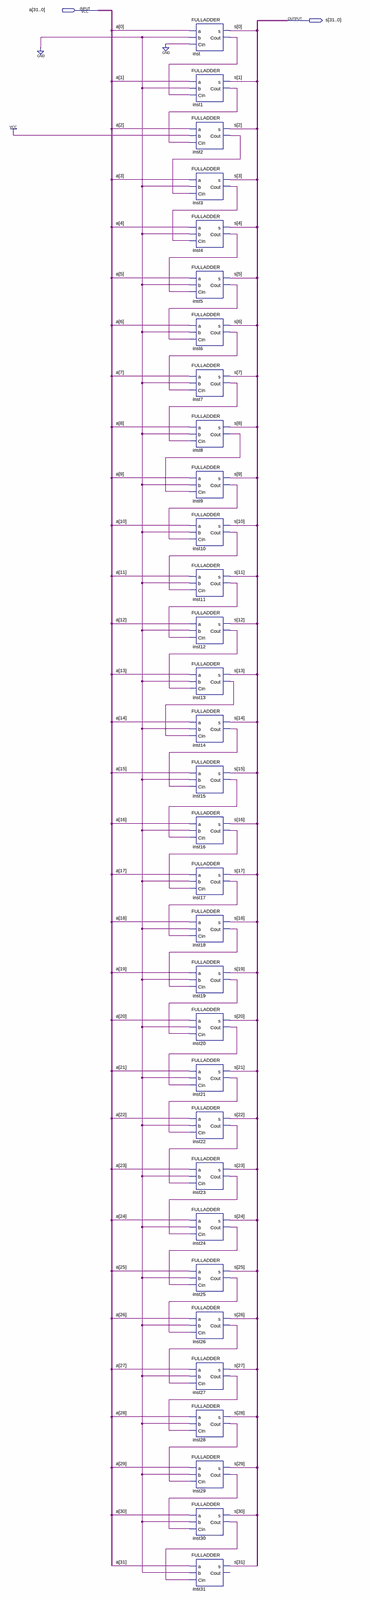
[diagram p0: schematic sheet, whole]
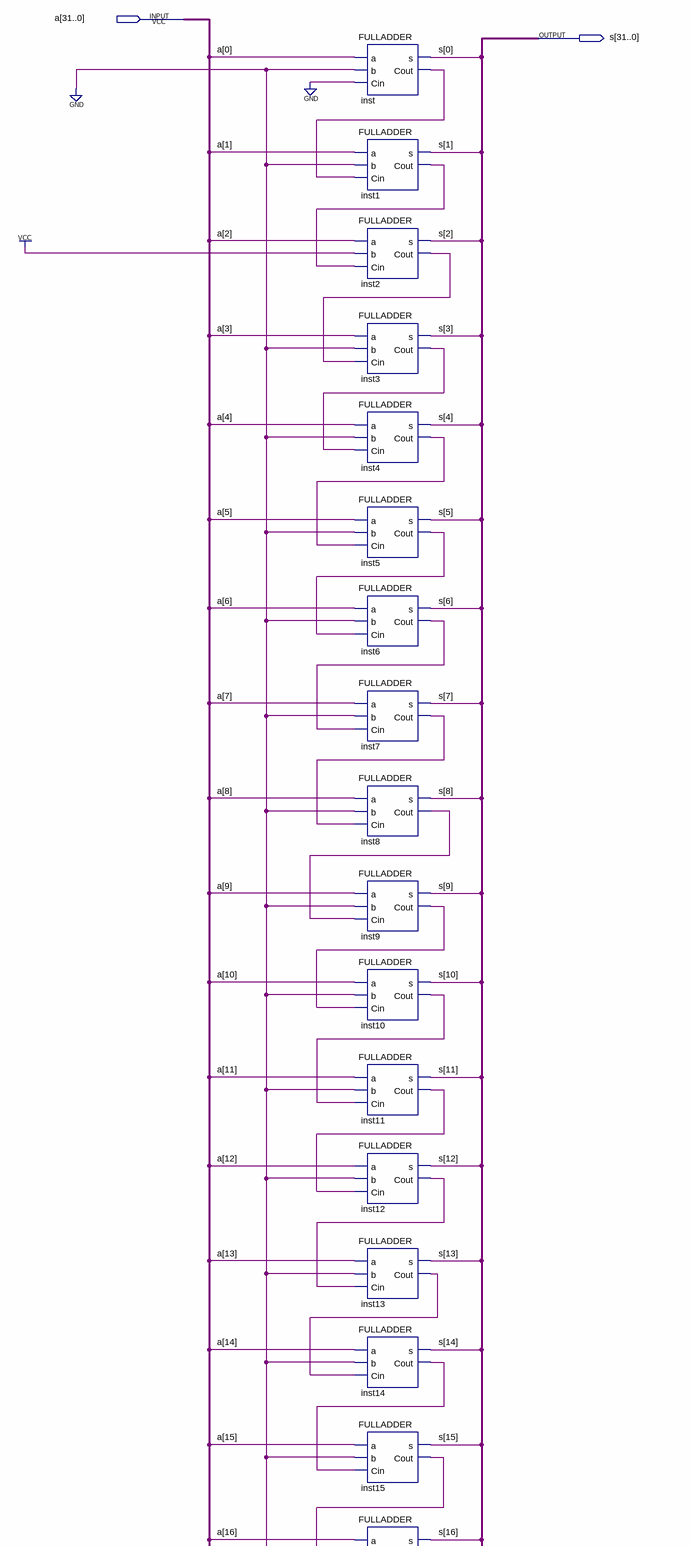
[diagram p1: schematic sheet, upper part]
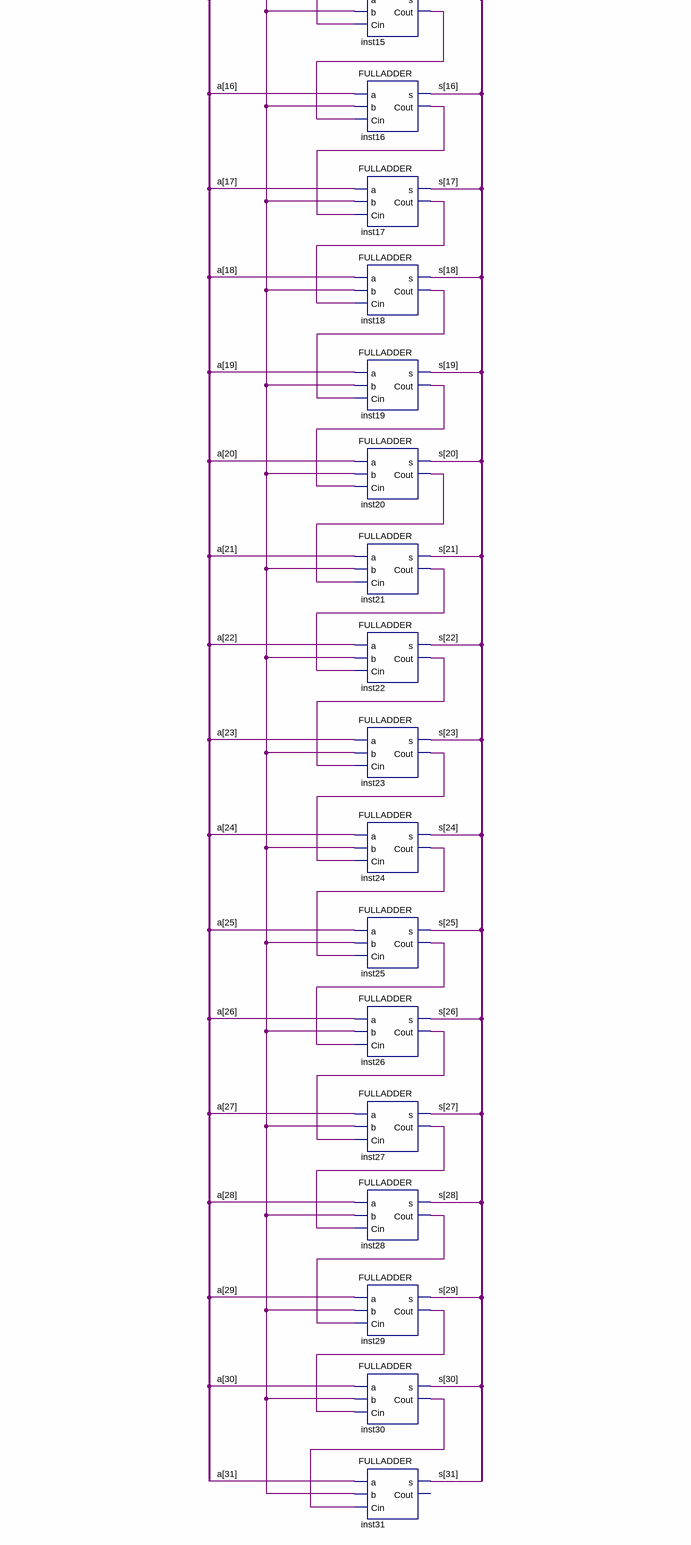
[diagram p2: schematic sheet, lower part]
// Quartus schematic ULA_PC.bdf as structural Verilog: 32 symbols, 2 pins
module ULA_PC (
  input  [31:0] a,
  output [31:0] s
);

  wire inst1_cout, inst2_cout, inst3_cout, inst4_cout, inst5_cout, inst6_cout, inst7_cout, inst8_cout,
       inst9_cout, inst10_cout, inst11_cout, inst12_cout, inst13_cout, inst14_cout, inst15_cout, inst16_cout,
       inst17_cout, inst18_cout, inst19_cout, inst20_cout, inst21_cout, inst22_cout, inst23_cout,
       inst24_cout, inst25_cout, inst26_cout, inst27_cout, inst28_cout, inst29_cout, inst30_cout, inst_cout;

  FULLADDER inst (.a(a[0]), .b(1'b0), .Cin(1'b0), .s(s[0]), .Cout(inst_cout));
  FULLADDER inst1 (.a(a[1]), .b(1'b0), .Cin(inst_cout), .s(s[1]), .Cout(inst1_cout));
  FULLADDER inst2 (.a(a[2]), .b(1'b1), .Cin(inst1_cout), .s(s[2]), .Cout(inst2_cout));
  FULLADDER inst3 (.a(a[3]), .b(1'b0), .Cin(inst2_cout), .s(s[3]), .Cout(inst3_cout));
  FULLADDER inst4 (.a(a[4]), .b(1'b0), .Cin(inst3_cout), .s(s[4]), .Cout(inst4_cout));
  FULLADDER inst5 (.a(a[5]), .b(1'b0), .Cin(inst4_cout), .s(s[5]), .Cout(inst5_cout));
  FULLADDER inst6 (.a(a[6]), .b(1'b0), .Cin(inst5_cout), .s(s[6]), .Cout(inst6_cout));
  FULLADDER inst7 (.a(a[7]), .b(1'b0), .Cin(inst6_cout), .s(s[7]), .Cout(inst7_cout));
  FULLADDER inst8 (.a(a[8]), .b(1'b0), .Cin(inst7_cout), .s(s[8]), .Cout(inst8_cout));
  FULLADDER inst9 (.a(a[9]), .b(1'b0), .Cin(inst8_cout), .s(s[9]), .Cout(inst9_cout));
  FULLADDER inst10 (.a(a[10]), .b(1'b0), .Cin(inst9_cout), .s(s[10]), .Cout(inst10_cout));
  FULLADDER inst11 (.a(a[11]), .b(1'b0), .Cin(inst10_cout), .s(s[11]), .Cout(inst11_cout));
  FULLADDER inst12 (.a(a[12]), .b(1'b0), .Cin(inst11_cout), .s(s[12]), .Cout(inst12_cout));
  FULLADDER inst13 (.a(a[13]), .b(1'b0), .Cin(inst12_cout), .s(s[13]), .Cout(inst13_cout));
  FULLADDER inst14 (.a(a[14]), .b(1'b0), .Cin(inst13_cout), .s(s[14]), .Cout(inst14_cout));
  FULLADDER inst15 (.a(a[15]), .b(1'b0), .Cin(inst14_cout), .s(s[15]), .Cout(inst15_cout));
  FULLADDER inst16 (.a(a[16]), .b(1'b0), .Cin(inst15_cout), .s(s[16]), .Cout(inst16_cout));
  FULLADDER inst17 (.a(a[17]), .b(1'b0), .Cin(inst16_cout), .s(s[17]), .Cout(inst17_cout));
  FULLADDER inst18 (.a(a[18]), .b(1'b0), .Cin(inst17_cout), .s(s[18]), .Cout(inst18_cout));
  FULLADDER inst19 (.a(a[19]), .b(1'b0), .Cin(inst18_cout), .s(s[19]), .Cout(inst19_cout));
  FULLADDER inst20 (.a(a[20]), .b(1'b0), .Cin(inst19_cout), .s(s[20]), .Cout(inst20_cout));
  FULLADDER inst21 (.a(a[21]), .b(1'b0), .Cin(inst20_cout), .s(s[21]), .Cout(inst21_cout));
  FULLADDER inst22 (.a(a[22]), .b(1'b0), .Cin(inst21_cout), .s(s[22]), .Cout(inst22_cout));
  FULLADDER inst23 (.a(a[23]), .b(1'b0), .Cin(inst22_cout), .s(s[23]), .Cout(inst23_cout));
  FULLADDER inst24 (.a(a[24]), .b(1'b0), .Cin(inst23_cout), .s(s[24]), .Cout(inst24_cout));
  FULLADDER inst25 (.a(a[25]), .b(1'b0), .Cin(inst24_cout), .s(s[25]), .Cout(inst25_cout));
  FULLADDER inst26 (.a(a[26]), .b(1'b0), .Cin(inst25_cout), .s(s[26]), .Cout(inst26_cout));
  FULLADDER inst27 (.a(a[27]), .b(1'b0), .Cin(inst26_cout), .s(s[27]), .Cout(inst27_cout));
  FULLADDER inst28 (.a(a[28]), .b(1'b0), .Cin(inst27_cout), .s(s[28]), .Cout(inst28_cout));
  FULLADDER inst29 (.a(a[29]), .b(1'b0), .Cin(inst28_cout), .s(s[29]), .Cout(inst29_cout));
  FULLADDER inst30 (.a(a[30]), .b(1'b0), .Cin(inst29_cout), .s(s[30]), .Cout(inst30_cout));
  FULLADDER inst31 (.a(a[31]), .b(1'b0), .Cin(inst30_cout), .s(s[31]));  // open: Cout
endmodule
